# EAGLE design berimbau (EAGLE 9.4.0)

## Sheet 1 of 2
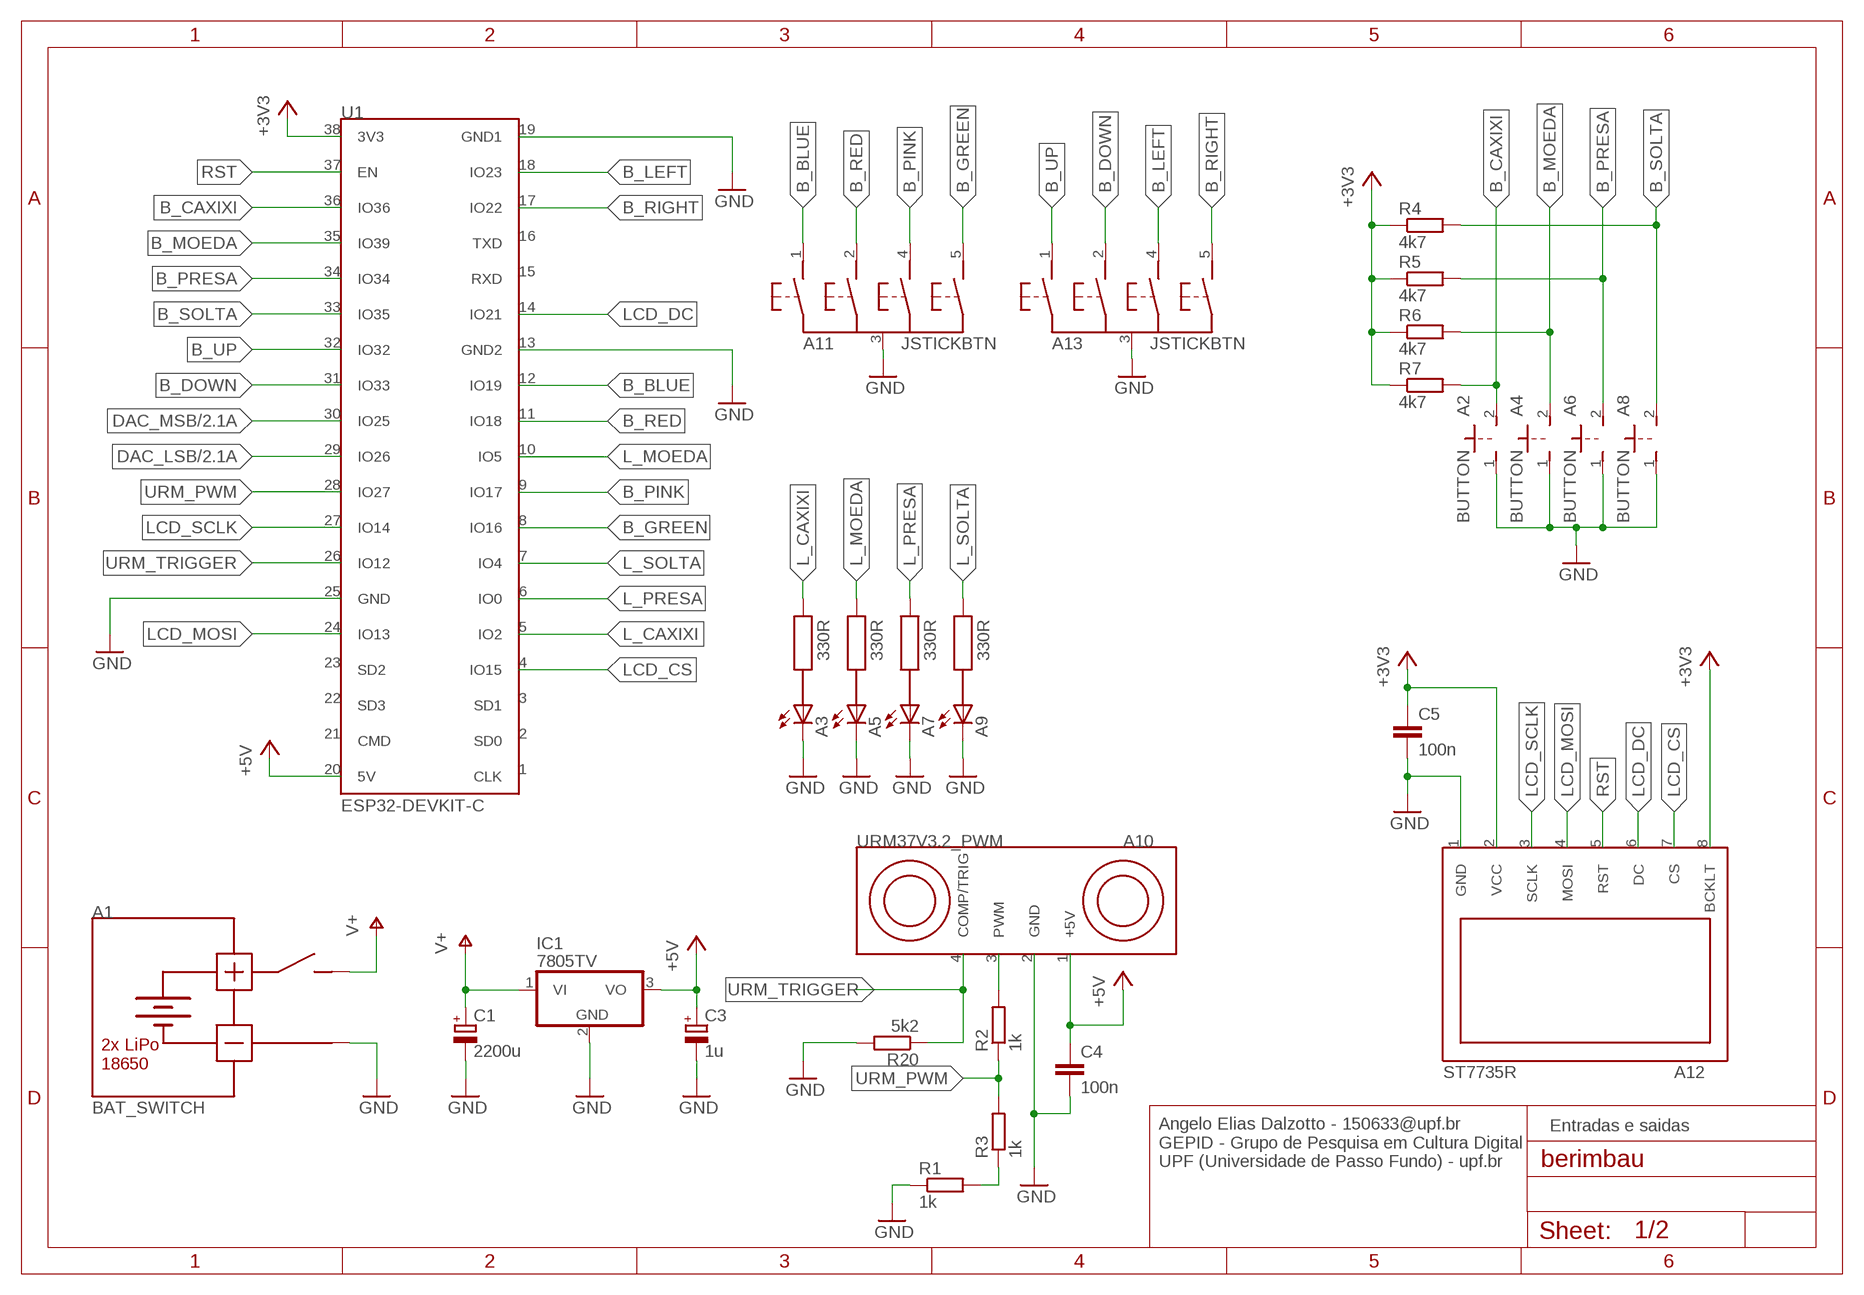
[diagram p0: schematic, sheet 1]

### Parts
A1  BAT_SWITCH  [1X02]
A2  BUTTON  [1X02]
A3  LED  [1X02]
A4  BUTTON  [1X02]
A5  LED  [1X02]
A6  BUTTON  [1X02]
A7  LED  [1X02]
A8  BUTTON  [1X02]
A9  LED  [1X02]
A10  URM37V3.2_PWM  [1X04]
A11  JSTICKBTN  [1X05]
A12  ST7735R  [1X08]
A13  JSTICKBTN  [1X05]
C1  2200u  CPOL-EUE3.5-10  [E3,5-10]
C3  1u  CPOL-EUE2-5  [E2-5]
C4  100n  C-EU050-030X075  [C050-030X075]
C5  100n  C-EU050-030X075  [C050-030X075]
IC1  7805TV  [TO220V]
R1  1k  R-EU_0207/10  [0207/10]
R2  1k  R-EU_0207/10  [0207/10]
R3  1k  R-EU_0207/10  [0207/10]
R4  4k7  R-EU_0207/10  [0207/10]
R5  4k7  R-EU_0207/10  [0207/10]
R6  4k7  R-EU_0207/10  [0207/10]
R7  4k7  R-EU_0207/10  [0207/10]
R20  5k2  R-EU_0207/10  [0207/10]
U1  ESP32-DEVKIT-C  [ESP32]

### Nets
+3V3: A12.2(VCC) A12.8(BCKLT) C5.1 R4.1 R5.1 R6.1 R7.1 U1.38(3V3)
+5V: A10.1(+5V) C3.+ C4.1 IC1.3(VO) U1.20(5V)
B_BLUE: A11.1(B1) U1.12(IO19)
B_CAXIXI: A2.2(S) R7.2 U1.36(IO36)
B_DOWN: A13.2(B2) U1.31(IO33)
B_GREEN: A11.5(B4) U1.8(IO16)
B_LEFT: A13.4(B3) U1.18(IO23)
B_MOEDA: A4.2(S) R6.2 U1.35(IO39)
B_PINK: A11.4(B3) U1.9(IO17)
B_PRESA: A6.2(S) R5.2 U1.34(IO34)
B_RED: A11.2(B2) U1.11(IO18)
B_RIGHT: A13.5(B4) U1.17(IO22)
B_SOLTA: A8.2(S) R4.2 U1.33(IO35)
B_UP: A13.1(B1) U1.32(IO32)
DAC_LSB: U1.29(IO26) ; also sheet 2
DAC_MSB: U1.30(IO25) ; also sheet 2
GND: A1.2(-) A2.1(P) A3.2(C) A4.1(P) A5.2(C) A6.1(P) A7.2(C) A8.1(P) A9.2(C) A10.2(GND) A11.3(COM) A12.1(GND) A13.3(COM) C1.- C3.- C4.2 C5.2 IC1.2(GND) R1.1 R20.2 U1.13(GND2) U1.19(GND1) U1.25(GND) ; also sheet 2
L_CAXIXI: A3.1(A) U1.5(IO2)
L_MOEDA: A5.1(A) U1.10(IO5)
L_PRESA: A7.1(A) U1.6(IO0)
L_SOLTA: A9.1(A) U1.7(IO4)
LCD_CS: A12.7(CS) U1.4(IO15)
LCD_DC: A12.6(DC) U1.14(IO21)
LCD_MOSI: A12.4(MOSI) U1.24(IO13)
LCD_SCLK: A12.3(SCLK) U1.27(IO14)
N$1: A10.3(PWM) R2.2
N$3: R1.2 R3.1
RST: A12.5(RST) U1.37(EN)
URM_PWM: R2.1 R3.2 U1.28(IO27)
URM_TRIGGER: A10.4(COMP/TRIG) R20.1 U1.26(IO12)
V+: A1.1(+) C1.+ IC1.1(VI) ; also sheet 2
Unconnected: U1.1(CLK) U1.2(SD0) U1.3(SD1) U1.15(RXD) U1.16(TXD) U1.21(CMD) U1.22(SD3) U1.23(SD2)

### Notes on the sheet
- Entradas e saidas
- Angelo Elias Dalzotto - 150633@upf.br
  GEPID - Grupo de Pesquisa em Cultura Digital
  UPF (Universidade de Passo Fundo) - upf.br

## Sheet 2 of 2
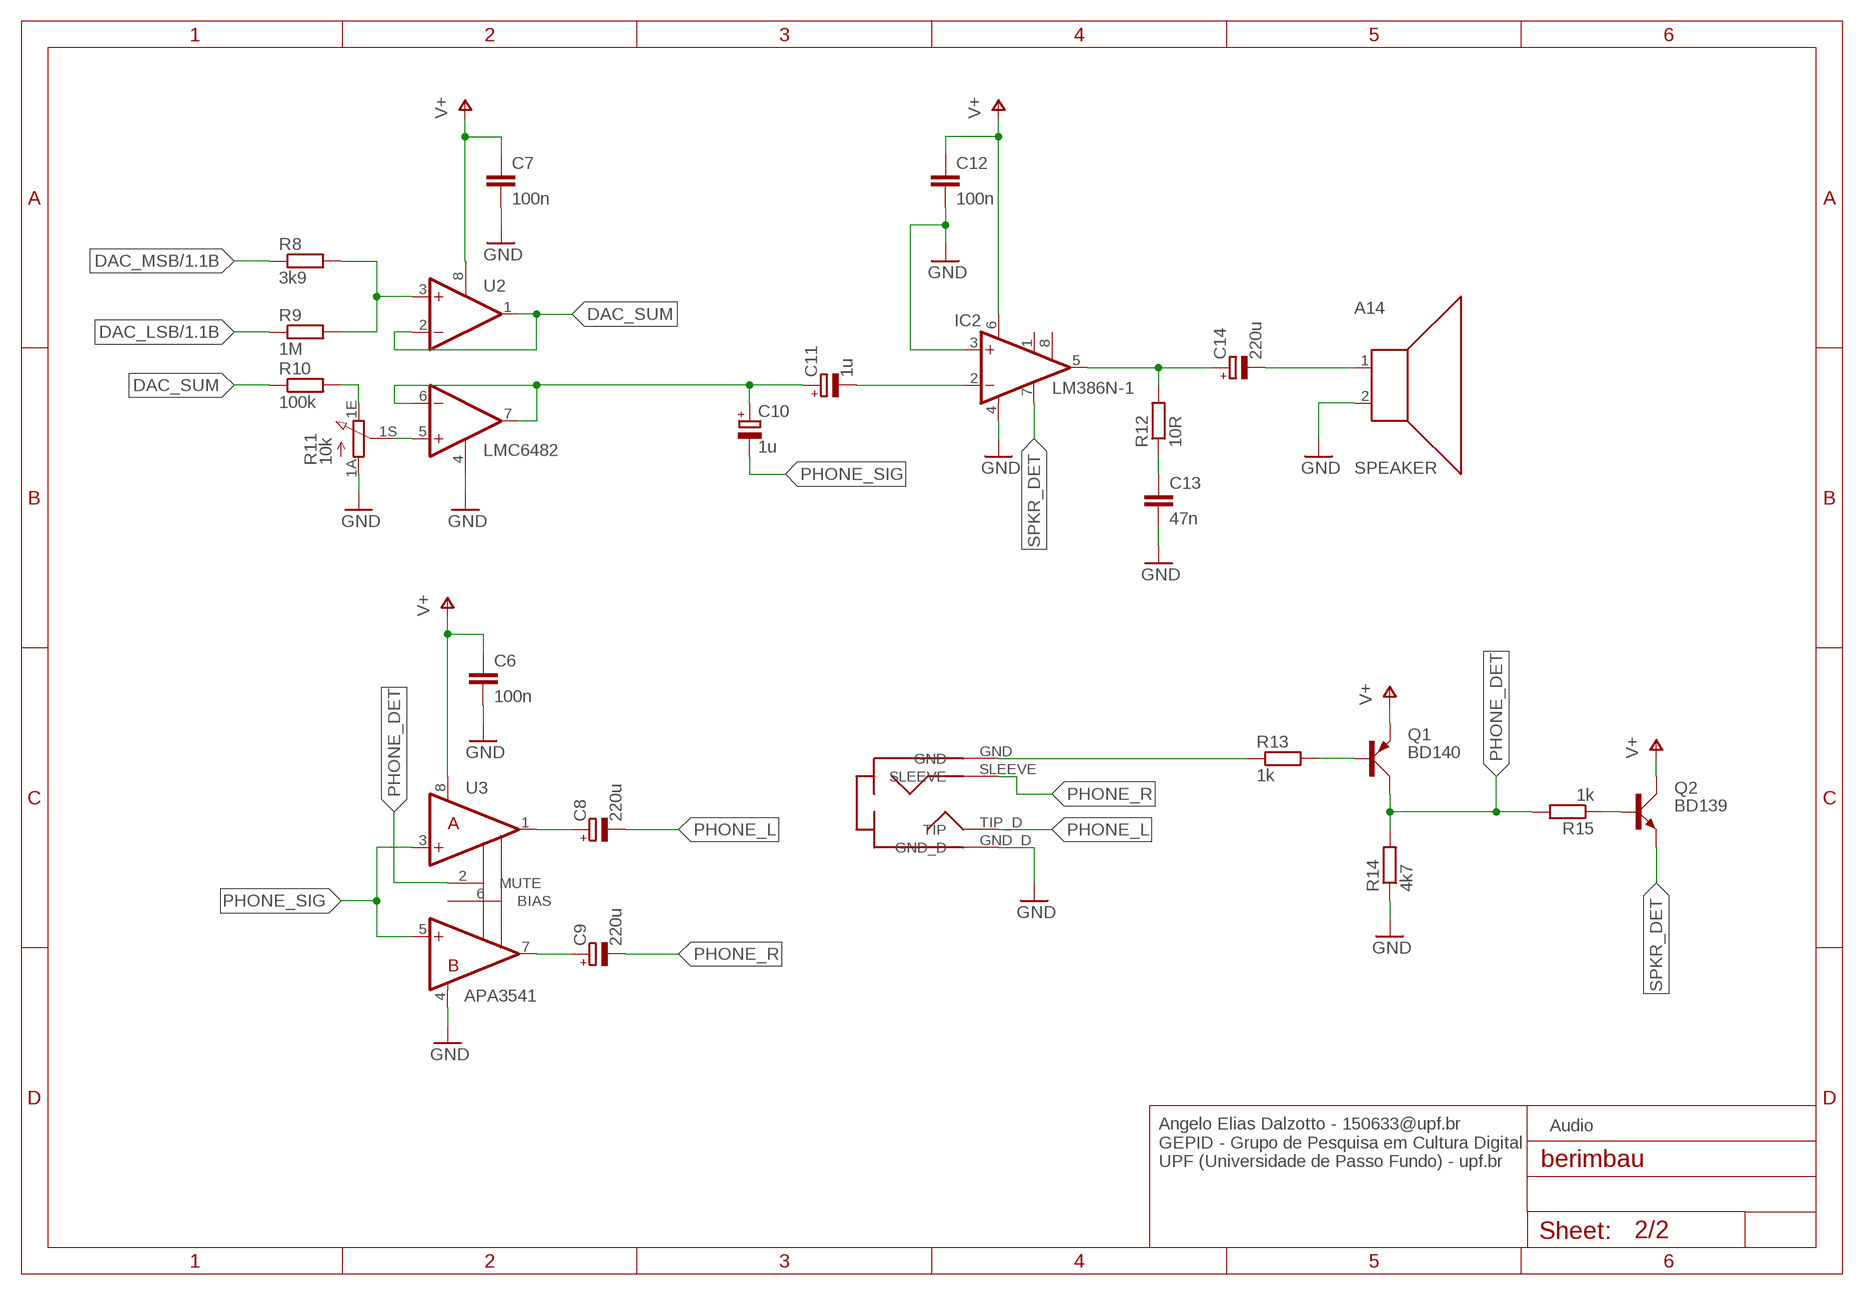
[diagram p1: schematic, sheet 2]

### Parts
A14  SPEAKER  [1X02]
C6  100n  C-EU050-030X075  [C050-030X075]
C7  100n  C-EU050-030X075  [C050-030X075]
C8  220u  CPOL-EUE2-5  [E2-5]
C9  220u  CPOL-EUE2-5  [E2-5]
C10  1u  CPOL-EUE2-5  [E2-5]
C11  1u  CPOL-EUE2-5  [E2-5]
C12  100n  C-EU050-030X075  [C050-030X075]
C13  47n  C-EU050-030X075  [C050-030X075]
C14  220u  CPOL-EUE3.5-10  [E3,5-10]
IC2  LM386N-1  [DIL08]
J1  P2_RPI  [P2_RASPI]
Q1  BD140  [TO126AV]
Q2  BD139  [TO126AV]
R8  3k9  R-EU_0207/10  [0207/10]
R9  1M  R-EU_0207/10  [0207/10]
R10  100k  R-EU_0207/10  [0207/10]
R11  10k  POT_SMALL  [PC16S]
R12  10R  R-EU_0207/10  [0207/10]
R13  1k  R-EU_0207/10  [0207/10]
R14  4k7  R-EU_0207/10  [0207/10]
R15  1k  R-EU_0207/10  [0207/10]
U2  LMC6482  [DIL08]
U3  APA3541  [DIL08]

### Nets
DAC_LSB: R9.1 ; also sheet 1
DAC_MSB: R8.1 ; also sheet 1
DAC_SUM: R10.1 U2.1(OUT_A) U2.2(-IN_A)
GND: A14.2(-) C6.2 C7.2 C12.2 C13.2 IC2.3(+IN) IC2.4(GND) J1.GND_D R11.1A(A) R14.1 U2.4(V-) U3.4(GND) ; also sheet 1
N$2: R11.1S(S) U2.5(+IN_B)
N$4: C10.+ C11.+ U2.6(-IN_B) U2.7(OUT_B)
N$5: R8.2 R9.2 U2.3(+IN_A)
N$6: R10.2 R11.1E(E)
N$7: J1.GND R13.1
N$9: C14.+ IC2.5(OUT) R12.2
N$10: C13.1 R12.1
N$11: A14.1(+) C14.-
N$12: C8.+ U3.1(OUT_A)
N$13: C9.+ U3.7(OUT_B)
N$14: Q1.B R13.2
N$17: Q2.B R15.1
PHONE_DET: Q1.C R14.2 R15.2 U3.2(MUTE)
PHONE_L: C8.- J1.TIP_D(TIP)
PHONE_R: C9.- J1.SLEEVE
PHONE_SIG: C10.- U3.3(+IN_A) U3.5(+IN_B)
SPKR_DET: IC2.7(BYPASS) Q2.E
SPKR_SIG: C11.- IC2.2(-IN)
V+: C6.1 C7.1 C12.1 IC2.6(VS) Q1.E Q2.C U2.8(V+) U3.8(VS1) ; also sheet 1
Unconnected: IC2.1(GAIN) IC2.8(GAIN) U3.6(BIAS)

### Notes on the sheet
- Audio
- Angelo Elias Dalzotto - 150633@upf.br
  GEPID - Grupo de Pesquisa em Cultura Digital
  UPF (Universidade de Passo Fundo) - upf.br

## Library data of the parts
A1 = angelo:BAT_SWITCH
A2 A4 A6 A8 = angelo:BUTTON
A3 A5 A7 A9 = angelo:LED
A10 = angelo:URM37V3.2_PWM
A11 A13 = angelo:JSTICKBTN
A12 = angelo:ST7735R
A14 = angelo:SPEAKER
C1 C3 C8-C11 C14 = rcl:CPOL-EU: POLARIZED CAPACITOR, European symbol; SPICEPREFIX: C
C4-C7 C12 C13 = rcl:C-EU: CAPACITOR, European symbol; SPICEPREFIX: C
IC1 = linear:78*: Positive VOLTAGE REGULATOR Source: http://cache.national.com/ds/LM/LM78L05.pdf http://www.fairchildsemi.com/ds/LM/LM7805.pdf
IC2 = linear:LM386?-*: Low Voltage Audio Power Amplifier Source: http://cache.national.com/ds/LM/LM386.pdf
J1 = angelo:P2_RPI
Q1 = transistor-power:BD140: PNP TRANSISTOR
Q2 = transistor-power:BD139: NPN TRANSISTOR
R1-R10 R12-R15 R20 = rcl:R-EU_: RESISTOR, European symbol; SPICEPREFIX: R
R11 = angelo:POT_SMALL
U1 = angelo:ESP32-DEVKIT-C
U2 = angelo:LMC6482
U3 = angelo:APA3541

## Net classes
0 default: clearance 0.205 mm

## Board
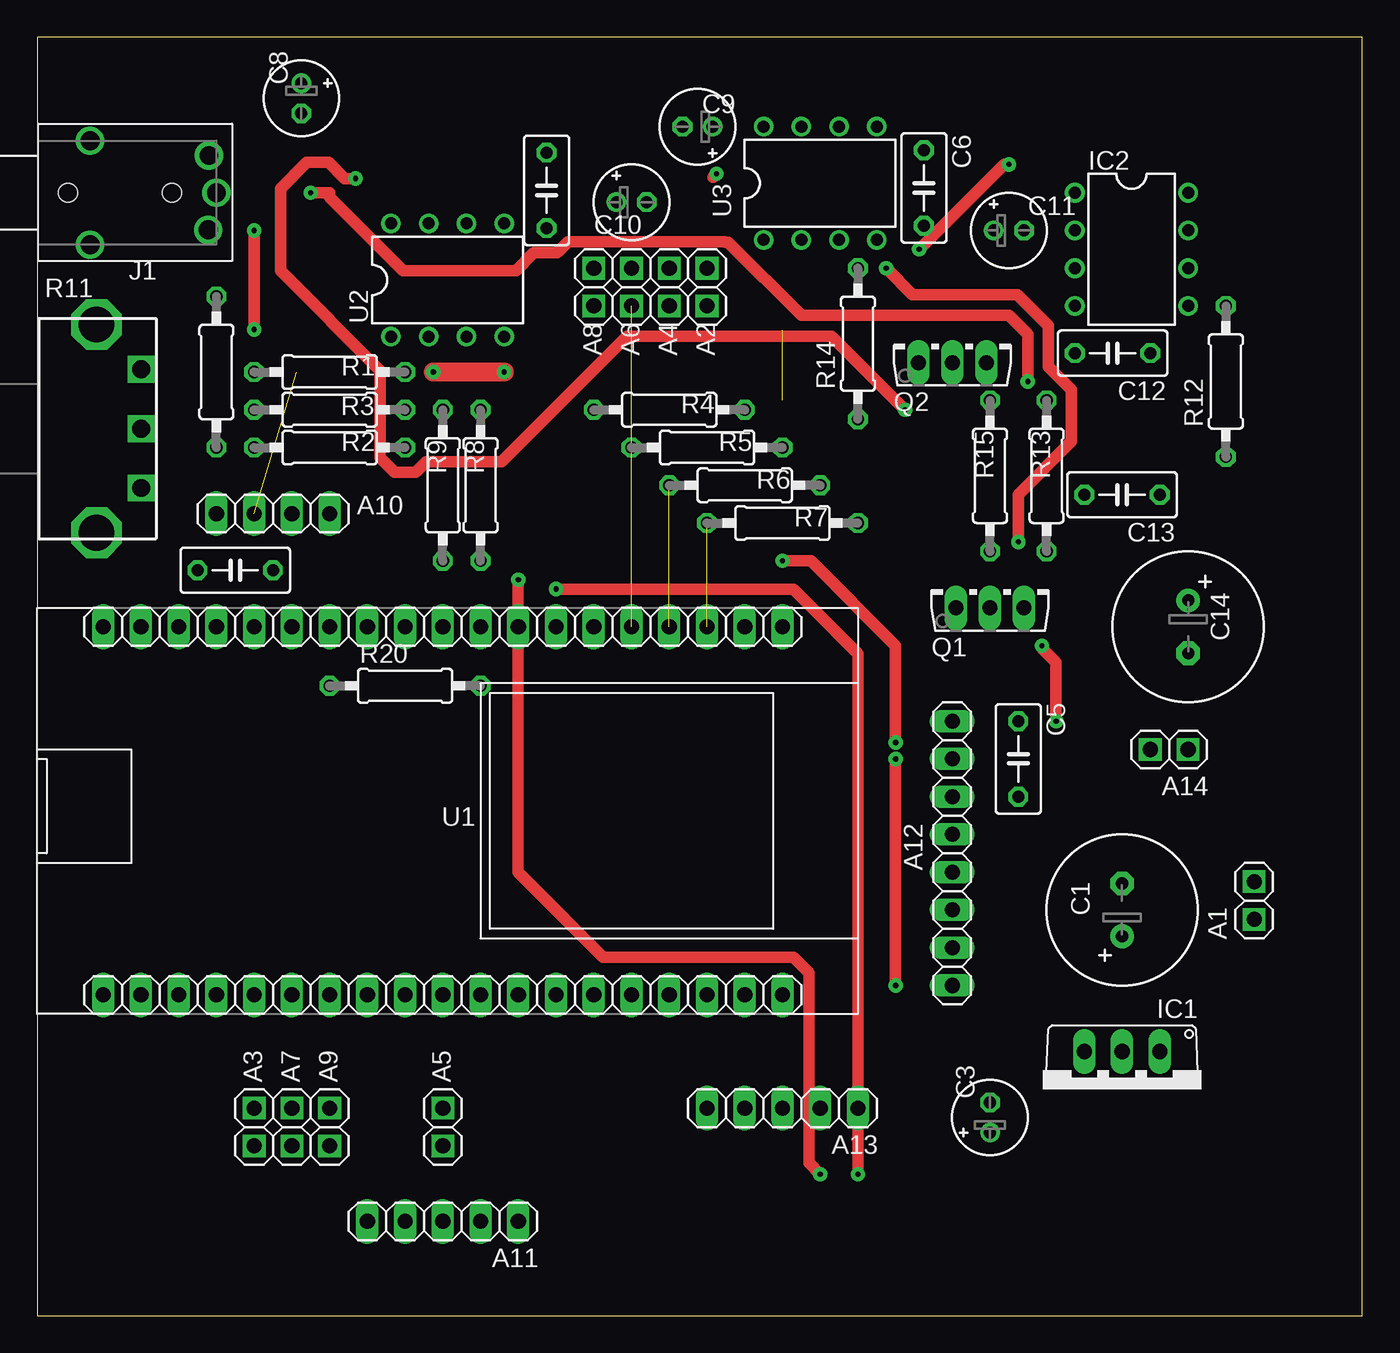
[diagram p2: board, top side]
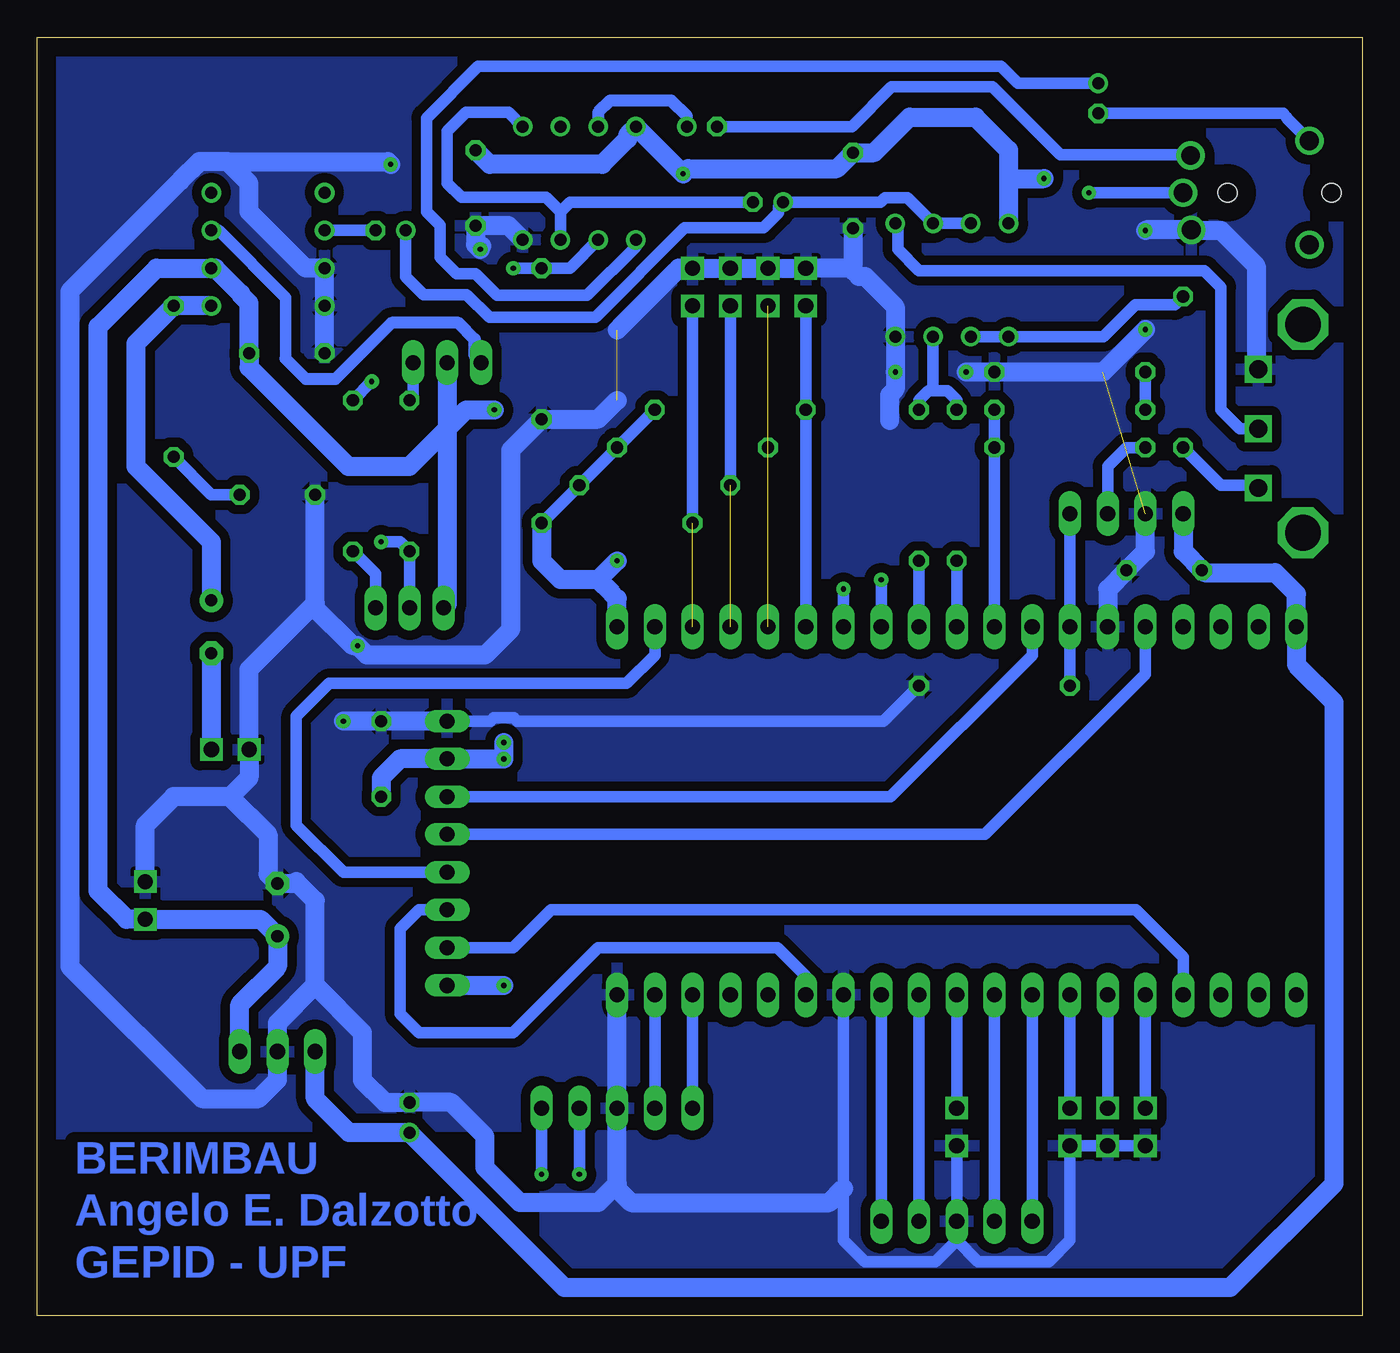
[diagram p3: board, bottom side, seen from below]

Size 89.2 x 86.03 mm. Coordinates in mm from the lower left corner, seen from the top.
Outline: 0,0 89.2,0 89.2,86.03 0,86.03 0,0
Copper layers (1*16): Top 0.035mm / dielectric 1.5mm / Bottom 0.035mm
Design rules "default *": minimum track width 30mil, minimum drill 0.35mm, track to track 25mil, track to pad 25mil, pad to pad 25mil, via to via 25mil, smd to smd 25mil, copper to edge 50mil, drill to drill 25mil, minimum pad ring 10mil, minimum via ring 12mil, stop-mask expansion 4mil, vias tented up to drill 0mil, thermal gap 10mil

### Footprints (pad centres in the part's own frame; a part is rotated, then mirrored left to right if it is on the bottom)
1X02 = drill 1.016 square: 1 -1.27,0; 2 1.27,0
1X04 = drill 1.016 long: 1 -3.81,0; 2 -1.27,0; 3 1.27,0; 4 3.81,0
1X05 = drill 1.016 long: 1 -5.08,0; 2 -2.54,0; 3 0,0; 4 2.54,0; 5 5.08,0
1X08 = drill 1.016 long: 1 -8.89,0; 2 -6.35,0; 3 -3.81,0; 4 -1.27,0; 5 1.27,0; 6 3.81,0; 7 6.35,0; 8 8.89,0
E3,5-10 = drill 0.813 pad 1.6: + -1.778,0 | drill 0.813 pad 1.6 octagon: - 1.778,0
E2-5 = drill 0.813 pad 1.27: + -1.016,0 | drill 0.813 pad 1.27 octagon: - 1.016,0
C050-030X075 = drill 0.813 octagon: 1 -2.54,0; 2 2.54,0
TO220V = drill 1.016 long: 1 -2.54,-2.54; 2 0,-2.54; 3 2.54,-2.54
DIL08 = drill 0.813 pad 1.27: 1 -3.81,-3.81; 2 -1.27,-3.81; 3 1.27,-3.81; 4 3.81,-3.81; 5 3.81,3.81; 6 1.27,3.81; 7 -1.27,3.81; 8 -3.81,3.81
P2_RASPI = drill 1.27: GND -6.35,0; GND_D -5.8,2.5; SLEEVE -5.85,-2.5; TIP 2.15,3.5; TIP_D 2.15,-3.5 | hole 1.27: -3.35,0; 3.65,0
TO126AV = drill 1.016 long: B 2.286,-1.27; C 0,-1.27; E -2.286,-1.27
0207/10 = drill 0.813 octagon: 1 -5.08,0; 2 5.08,0
PC16S = drill 1.2 square: 1A -4,7; 1E 4,7; 1S 0,7 | drill 2.4 octagon: P$1 7,4; P$2 -7,4
ESP32 = drill 1.016 long: 1 -22.86,0; 2 -20.32,0; 3 -17.78,0; 4 -15.24,0; 5 -12.7,0; 6 -10.16,0; 7 -7.62,0; 8 -5.08,0; 9 -2.54,0; 10 0,0; 11 2.54,0; 12 5.08,0; 13 7.62,0; 14 10.16,0; 15 12.7,0; 16 15.24,0; 17 17.78,0; 18 20.32,0; 19 22.86,0; 20 -22.86,24.765; 21 -20.32,24.765; 22 -17.78,24.765; 23 -15.24,24.765; 24 -12.7,24.765; 25 -10.16,24.765; 26 -7.62,24.765; 27 -5.08,24.765; 28 -2.54,24.765; 29 0,24.765; 30 2.54,24.765; 31 5.08,24.765; 32 7.62,24.765; 33 10.16,24.765; 34 12.7,24.765; 35 15.24,24.765; 36 17.78,24.765; 37 20.32,24.765; 38 22.86,24.765

### Placement (x,y rotation side)
A1  81.92,27.94 90 top
A2  45.09,69.22 270 top
A3  14.6,12.7 270 top
A4  42.54,69.22 270 top
A5  27.3,12.7 270 top
A6  40,69.22 270 top
A7  17.14,12.7 270 top
A8  37.46,69.22 270 top
A9  19.69,12.7 270 top
A10  15.87,53.98 0 top
A11  27.3,6.35 180 top
A12  61.59,31.11 270 top
A13  50.16,13.97 180 top
A14  76.2,38.1 180 top
C1  73.03,27.3 90 top
C3  64.14,13.34 90 top
C4  13.33,50.16 0 top
C5  66.04,37.47 90 top
C6  59.69,75.88 270 top
C7  34.29,75.72 270 top
C8  17.78,81.92 270 top
C9  44.45,80.01 180 top
C10  40,74.93 0 top
C11  65.41,73.03 0 top
C12  72.39,64.77 180 top
C13  73.03,55.24 180 top
C14  77.47,46.35 270 top
IC1  73.03,15.24 180 top
IC2  73.66,71.75 270 top
J1  5.71,75.56 180 top
Q1  64.14,48.9 0 top
Q2  61.59,65.41 0 top
R1  19.69,63.5 180 top
R2  19.69,58.42 180 top
R3  19.69,60.96 0 top
R4  42.54,60.96 180 top
R5  45.09,58.42 180 top
R6  47.62,55.88 180 top
R7  50.16,53.34 180 top
R8  29.85,55.88 90 top
R9  27.3,55.88 90 top
R10  12.06,63.5 270 top
R11  0,59.69 270 top
R12  80.01,62.87 90 top
R13  67.95,56.52 270 top
R14  55.24,65.41 90 top
R15  64.14,56.52 270 top
R20  24.77,42.39 0 top
U1  27.3,21.59 0 top
U2  27.62,69.69 0 top
U3  52.7,76.2 0 top

### Tracks (layer width: path | path; a pad name or v marks a point on that pad's centre or on a via)
+3V3  (via drill 0.35)
  Top 0.762: v57.78,37.47 v57.78,22.23 | v50.17,50.8 52.07,50.8 57.78,45.09 v57.78,38.58
  Bottom 0.762: R4.1 R5.1 R6.1 R7.1 | 50.17,48.26 50.48,48.58
  Bottom 1.27: C5.1 66.04,36.2 64.77,37.47 A12.2 v57.78,37.47 v57.78,38.58 | A12.8 v57.78,22.23 | U1.38 50.17,48.26 | 50.48,48.58 51.43,49.53 | 51.43,49.53 53.97,49.53 55.24,50.8 R7.1 | 51.43,49.53 v50.17,50.8
+5V
  Bottom 1.27: A10.1 12.07,51.44 C4.1 10.64,50.01 5.87,50.01 4.45,48.58 U1.20 4.45,43.81 1.91,41.27 1.91,8.89 8.89,1.91 53.72,1.91 C3.+ 68.2,12.32 70.48,14.61 IC1.3
B_BLUE
  Bottom 0.762: U1.12 A11.1
B_CAXIXI  (1 unrouted)
  Bottom 0.762: A2.2 R7.2
B_DOWN  (via drill 0.35)
  Top 0.762: v32.39,49.53 32.39,29.84 38.1,24.13 50.9,24.13 51.94,23.09 51.94,10.29 v52.71,9.53
  Bottom 0.762: A13.2 v52.71,9.53 | U1.31 v32.39,49.53
B_GREEN
  Bottom 0.762: U1.8 A11.5
B_LEFT
  Bottom 0.762: U1.18 A13.4
B_MOEDA  (1 unrouted)
  Bottom 0.762: A4.2 R6.2
B_PINK
  Bottom 0.762: U1.9 A11.4
B_PRESA  (2 unrouted)
B_RED
  Bottom 0.762: U1.11 A11.2
B_RIGHT
  Bottom 0.762: U1.17 A13.5
B_SOLTA
  Bottom 0.762: U1.33 A8.2 R4.2
B_UP  (via drill 0.35)
  Top 0.762: v34.92,48.9 50.9,48.9 55.24,44.55 v55.24,9.53
  Bottom 0.762: A13.1 v55.24,9.53 | U1.32 v34.92,48.9
DAC_LSB
  Bottom 0.762: R9.1 U1.29
DAC_MSB
  Bottom 0.762: R8.1 U1.30
DAC_SUM
  Bottom 0.762: U2.2 U2.1 17.42,65.88 15.29,68.01 12.64,68.01 R10.1
GND  (via drill 0.35)  (2 unrouted)
  Top 0.762: v14.6,73.03 v14.6,66.36 | v59.37,71.75 65.09,77.47 v65.4,77.47 | v68.58,40.01 68.58,43.97 67.63,44.93 v67.63,45.09
  Top 1.27: v31.43,63.5 v26.67,63.5
  Bottom 0.762: A2.1 46.35,70.48 50.17,66.67 | A5.2 A11.3 27.3,5.08 | A3.2 A7.2 A9.2 19.69,5.08 21.11,3.65 25.88,3.65 27.3,5.08 | 27.3,5.08 28.73,3.65 33.5,3.65 34.92,5.08 34.92,8.57 U1.13 | R20.2 32.23,40.01 56.88,40.01 57.1,40.23 58.47,40.23 58.69,40.01 A12.1
  Bottom 1.27: U1.25 17.14,48.9 C4.2 14.6,51.44 A10.2 | R11.1A 7.14,63.83 7.14,70.64 9.52,73.03 11.48,73.03 J1.GND_D 14.57,73.06 v14.6,73.03 | 70.64,47.78 74.93,43.5 A14.2 74.93,36.2 76.2,34.92 | C13.2 70.48,47.94 70.64,47.78 | 50.17,61.59 51.43,60.33 R14.1 57.31,58.26 57.31,46.2 59.06,44.45 66.99,44.45 v67.63,45.09 67.95,45.09 70.64,47.78 | 50.17,66.32 46,70.48 A2.1 A4.1 A6.1 A8.1 34.46,70.48 | C12.2 IC2.4 IC2.3 71.12,70.48 74.93,74.3 74.93,76.2 76.38,77.65 | U3.4 57.47,73.34 C6.2 59.69,72.07 v59.37,71.75 59.37,71.87 59.25,71.99 | A12.1 C5.2 v68.58,40.01 | 76.2,34.92 80.01,34.92 81.92,33.02 A1.2 | 70.48,22.23 70.48,27.94 71.76,29.21 71.88,29.08 C1.- 73.66,29.72 73.66,32.38 76.2,34.92 | 50.32,8.73 51.43,7.62 56.71,7.62 59.06,9.97 59.06,12.06 61.34,14.35 C3.- 65.79,14.35 67.31,15.88 67.31,19.05 70.48,22.23 | 50.32,8.73 50.17,8.89 A13.3 U1.19 | 76.38,77.65 78.27,77.65 79.56,76.36 86.99,68.92 86.99,23.5 78.1,14.61 74.29,14.61 73.03,15.88 IC1.2 73.03,19.68 70.48,22.23 | v26.67,63.5 R1.1 17.46,63.5 v14.6,66.36 | 76.38,77.65 65.59,77.65 v65.4,77.47 | 50.32,8.73 49.21,7.62 35.88,7.62 34.92,8.57 | C7.2 34.29,70.65 34.46,70.48 | 34.46,70.48 33.9,69.93 33.47,69.93 31.43,67.89 U2.4 v31.43,63.5 31.43,62.34 31.83,61.95 31.83,60.25
  pour Bottom (isolate 0.61): 0,85.72 89.54,85.72 89.54,0 0,0
L_CAXIXI
  Bottom 0.762: U1.5 A3.1
L_MOEDA
  Bottom 0.762: A5.1 U1.10
L_PRESA
  Bottom 0.762: U1.6 A7.1
L_SOLTA
  Bottom 0.762: A9.1 U1.7
LCD_CS
  Bottom 0.762: A12.7 57.15,24.77 54.61,27.3 15.24,27.3 12.07,24.13 U1.4
LCD_DC
  Bottom 0.762: U1.14 37.46,22.86 39.37,24.77 51.43,24.77 57.15,19.05 63.5,19.05 64.77,20.32 64.77,26.04 63.5,27.3 A12.6
LCD_MOSI
  Bottom 0.762: U1.24 14.6,43.18 25.4,32.38 A12.4
LCD_SCLK
  Bottom 0.762: U1.27 22.23,44.45 31.75,34.92 A12.3
N$1
  Bottom 0.762: R2.2 15.87,58.42 17.14,57.15 A10.3
N$2
  Bottom 0.762: R11.1S 8.25,59.69 9.52,60.96 9.52,69.22 10.64,70.33 29.85,70.33 31.27,71.75 31.27,73.34 U2.5
N$3
  Bottom 0.762: R3.1 R1.2
N$4
  Bottom 0.762: C11.+ 64.39,69.91 63.18,68.71 60.28,68.71 58.76,67.19 51.63,67.19 45.61,73.2 40.31,73.2 39.29,74.22 39.29,74.62 C10.+ 32.45,74.93 32.15,75.23 30.62,75.23 U2.6 U2.7
N$5
  Bottom 0.762: R9.2 27.3,61.59 27.94,62.23 28.89,62.23 | R8.2 29.85,61.59 29.21,62.23 28.89,62.23 | U2.3 28.89,62.23
N$6
  Bottom 0.762: R10.2 9.52,55.88 7.19,55.88 R11.1E
N$7  (via drill 0.35)
  Top 0.762: v18.42,75.56 19.69,75.56 19.69,75.26 24.62,70.33 32.23,70.33 33.41,71.51 34.98,71.51 35.74,72.26 46.27,72.26 46.3,72.23 46.51,72.23 51.43,67.31 65.4,67.31 66.68,66.04 v66.68,62.87
  Bottom 0.762: J1.GND v18.42,75.56 | v66.68,62.87 R13.1
N$9
  Bottom 1.27: IC2.5 R12.2 82.55,65.41 82.55,57.15 77.47,52.07 C14.+
N$10
  Bottom 0.762: R12.1 77.47,55.24 C13.1
N$11
  Bottom 1.27: C14.- A14.1
N$12
  Bottom 0.762: C8.+ 23.17,82.93 24.31,84.07 59.51,84.07 62.99,80.59 62.99,74.3 62.08,73.38 62.08,71.22 60.96,70.1 59.7,70.1 58.25,68.65 52.17,68.65 48.89,71.92 U3.1
N$13
  Bottom 0.813: C9.+ 45.47,80.71 46.52,81.76 50.63,81.76 51.43,80.96 U3.7
N$14
  Bottom 0.762: Q1.B 66.42,49.91 R13.2
N$17
  Bottom 0.762: Q2.B 63.88,61.85 R15.1
PHONE_DET  (via drill 0.35)
  Top 0.762: v57.15,70.48 58.93,68.71 65.98,68.71 68.07,66.62 68.07,63.84 69.62,62.29 69.62,58.83 66.04,55.24 v66.04,52.07
  Bottom 0.762: U3.2 53.34,70.48 R14.2 v57.15,70.48 | Q1.C R15.2 64.77,52.07 v66.04,52.07
PHONE_L
  Bottom 0.762: J1.TIP_D 5.08,80.58 5.08,80.64 5.33,80.9 C8.-
PHONE_R
  Bottom 0.762: C9.- 34.36,80.01 31.69,82.68 24.89,82.68 20.32,78.11 11.6,78.11 J1.SLEEVE
PHONE_SIG
  Bottom 0.762: U3.3 53.97,74.3 | 53.97,74.3 53.34,74.93 C10.- | 53.97,74.3 54.93,75.25 60.64,75.25 61.6,76.2 61.6,79.69 60.32,80.96 57.47,80.96 U3.5
RST
  Bottom 0.762: A12.5 68.58,29.84 71.76,33.02 71.76,40.32 69.53,42.55 49.53,42.55 47.63,44.45 U1.37
SPKR_DET
  Bottom 0.762: IC2.7 76.99,73.03 72.48,68.51 72.48,64.39
  Bottom 0.813: Q2.E 59.74,64.57 59.74,65.72 60.83,66.8 65.34,66.8 69.12,63.02 71.1,63.02 72.48,64.39
SPKR_SIG
  Bottom 0.762: C11.- IC2.2
URM_PWM
  Bottom 0.762: R3.2 R2.1 U1.28
URM_TRIGGER
  Bottom 0.762: A10.4 U1.26 R20.1
V+  (via drill 0.35)
  Top 0.762: v58.42,60.96 53.47,65.91 39.72,65.91 31.27,57.47 26.18,57.47 25.46,56.74 24.07,56.74 23.09,57.73 23.09,63.6 16.38,70.31 16.38,75.83 18.15,77.6 19.63,77.6 20.71,76.52 v21.43,76.52 | v45.72,76.83 45.49,76.61
  Bottom 1.27: C6.1 58.74,77.47 51.17,77.47 49.45,79.19 49.45,79.45 U3.8 v45.72,76.83 45.38,77.18 35.38,77.18 C7.1 32.86,78.26 30.48,80.64 26.03,80.64 23.81,78.42 23.81,76.52 | 23.81,76.52 U2.8 | Q2.C 61.6,59.69 | 61.6,59.69 61.6,47.88 Q1.E | 61.6,59.69 64.14,57.15 68.26,57.15 74.93,63.82 C12.1 74.93,68.14 75.49,68.69 75.49,68.77 77.21,70.48 IC2.6 81.15,70.48 85.09,66.55 85.09,28.57 83.18,26.67 A1.1 74.17,26.67 C1.+ 73.03,23.5 75.56,20.95 IC1.1 | 61.6,59.69 60.32,60.96 v58.42,60.96 | 23.81,76.52 v21.43,76.52

### Text on the board
Bottom: BERIMBAU / Angelo E. Dalzotto / GEPID - UPF